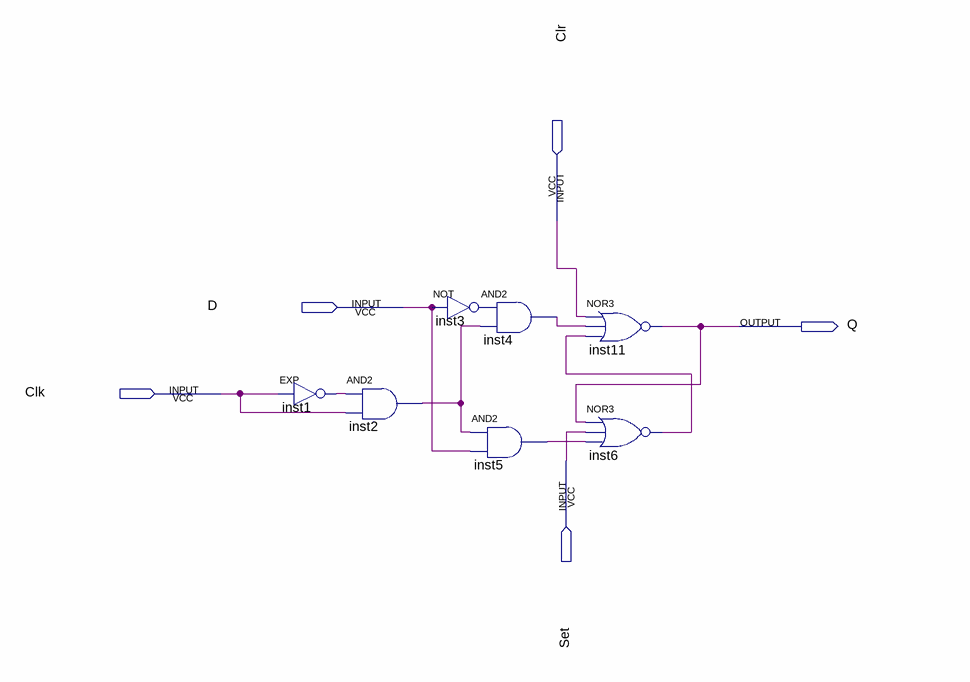
[diagram p0: schematic sheet]
// Quartus schematic Flipflop_dsetclr.bdf as structural Verilog: 7 symbols, 5 pins
module Flipflop_dsetclr (
  input  Clr,
  input  D,
  input  Clk,
  input  Set,
  output Q
);

  wire inst1_out, inst2_out, inst3_out, inst4_out, inst5_out, inst6_out;

  EXP inst1 (.IN(Clk), .OUT(inst1_out));
  and inst2 (inst2_out, inst1_out, Clk);
  not inst3 (inst3_out, D);
  and inst4 (inst4_out, inst3_out, inst2_out);
  and inst5 (inst5_out, inst2_out, D);
  nor inst11 (Q, Clr, inst4_out, inst6_out);
  nor inst6 (inst6_out, Q, Set, inst5_out);
endmodule
